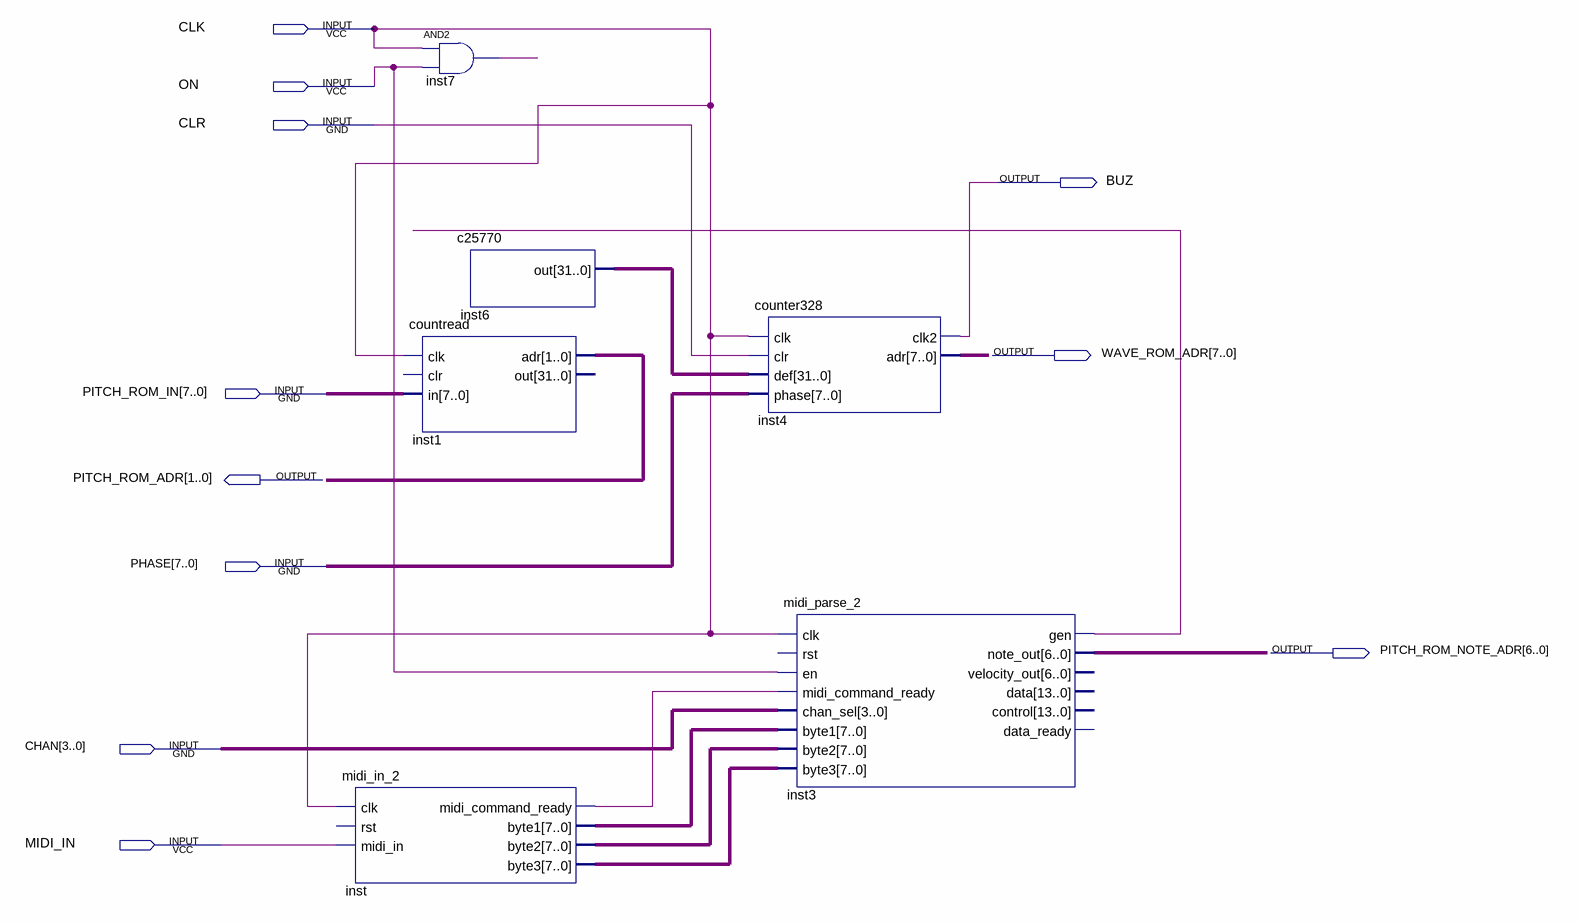
[diagram p0: schematic sheet]
// Quartus schematic COUNTER-TEST-N4.bdf as structural Verilog: 6 symbols, 11 pins
module \COUNTER-TEST-N4  (
  input  CLK,
  input  ON,
  input  CLR,
  input  [7:0] PITCH_ROM_IN,
  input  [7:0] PHASE,
  input  [3:0] CHAN,
  input  MIDI_IN,
  output BUZ,
  output [7:0] WAVE_ROM_ADR,
  output [1:0] PITCH_ROM_ADR,
  output [6:0] PITCH_ROM_NOTE_ADR
);

  wire inst3_gen, inst7_out, inst_midi_command_ready;
  wire [7:0] inst_byte1, inst_byte2, inst_byte3;
  wire [31:0] inst6_out;

  midi_in_2 inst (
    .clk(CLK), .midi_in(MIDI_IN), .midi_command_ready(inst_midi_command_ready), .byte1(inst_byte1),
    .byte2(inst_byte2), .byte3(inst_byte3));  // open: rst
  and inst7 (inst7_out, CLK, ON);
  countread inst1 (.clk(CLK), .in(PITCH_ROM_IN), .adr(PITCH_ROM_ADR));  // open: clr, out
  c25770 inst6 (.out(inst6_out));
  counter328 inst4 (.clk(CLK), .clr(CLR), .def(inst6_out), .phase(PHASE), .clk2(BUZ), .adr(WAVE_ROM_ADR));
  midi_parse_2 inst3 (
    .clk(CLK), .en(ON), .midi_command_ready(inst_midi_command_ready), .chan_sel(CHAN), .byte1(inst_byte1),
    .byte2(inst_byte2), .byte3(inst_byte3), .gen(inst3_gen), .note_out(PITCH_ROM_NOTE_ADR));  // open: rst, velocity_out, data, control, data_ready
endmodule
